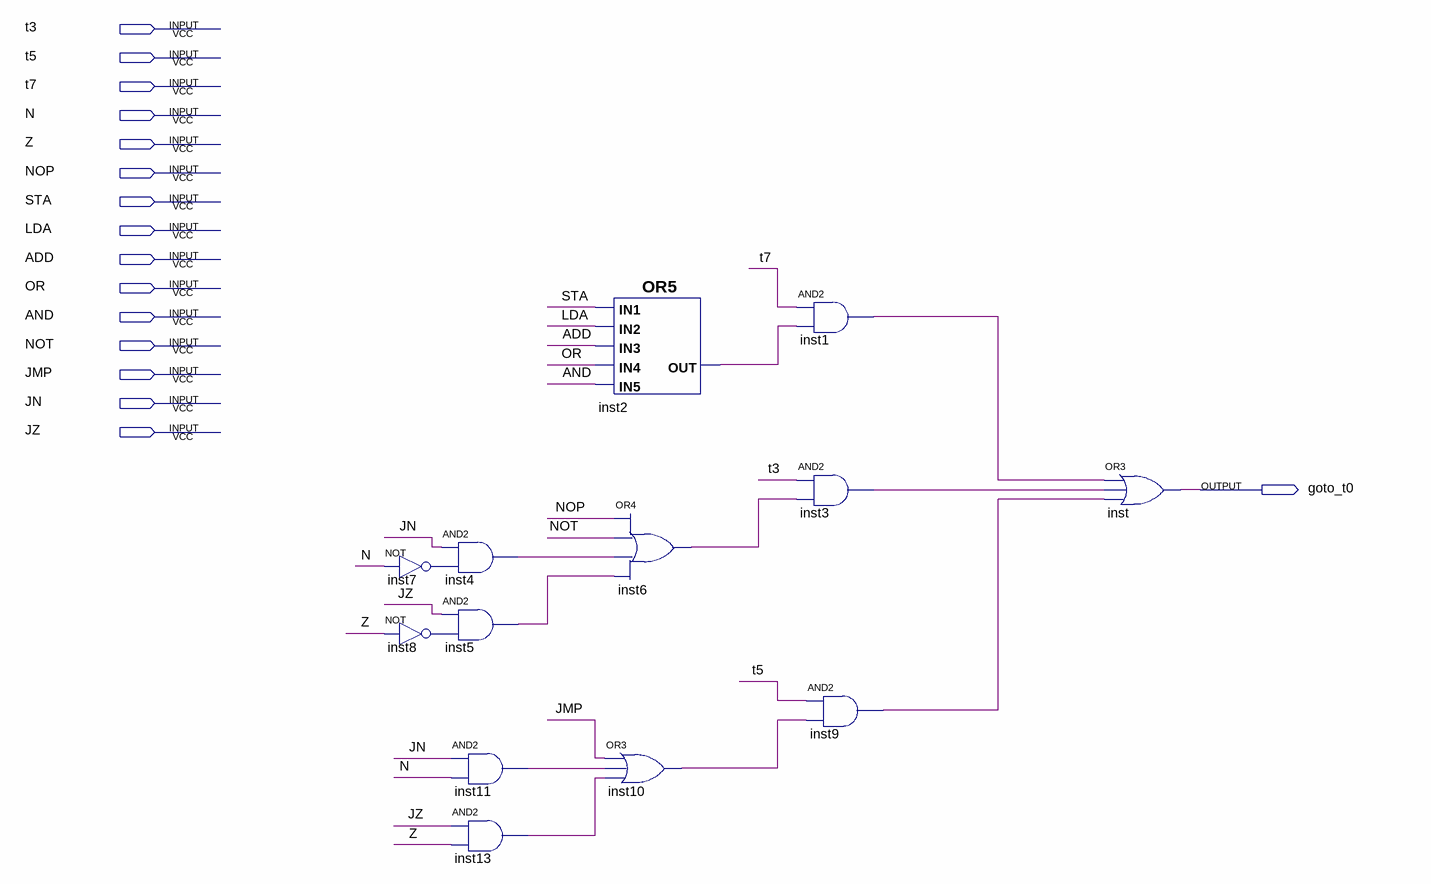
[diagram p0: schematic sheet]
// Quartus schematic goto_t0.bdf as structural Verilog: 13 symbols, 16 pins
module goto_t0 (
  input  t3,
  input  t5,
  input  t7,
  input  N,
  input  Z,
  input  NOP,
  input  STA,
  input  LDA,
  input  ADD,
  input  OR,
  input  AND,
  input  NOT,
  input  JMP,
  input  JN,
  input  JZ,
  output goto_t0
);

  wire inst1_out, inst2_out, inst3_out, inst4_out, inst5_out, inst6_out, inst7_out, inst8_out, inst9_out,
       inst10_out, inst11_out, inst13_out;

  not inst7 (inst7_out, N);
  not inst8 (inst8_out, Z);
  and inst4 (inst4_out, JN, inst7_out);
  and inst5 (inst5_out, JZ, inst8_out);
  and inst11 (inst11_out, JN, N);
  and inst13 (inst13_out, JZ, Z);
  or inst2 (inst2_out, STA, LDA, ADD, OR, AND);
  or inst6 (inst6_out, NOP, NOT, inst4_out, inst5_out);
  or inst10 (inst10_out, JMP, inst11_out, inst13_out);
  and inst1 (inst1_out, t7, inst2_out);
  and inst3 (inst3_out, t3, inst6_out);
  and inst9 (inst9_out, t5, inst10_out);
  or inst (goto_t0, inst1_out, inst3_out, inst9_out);
endmodule
